# EAGLE schematic soar-noflash (EAGLE 8.3.1)
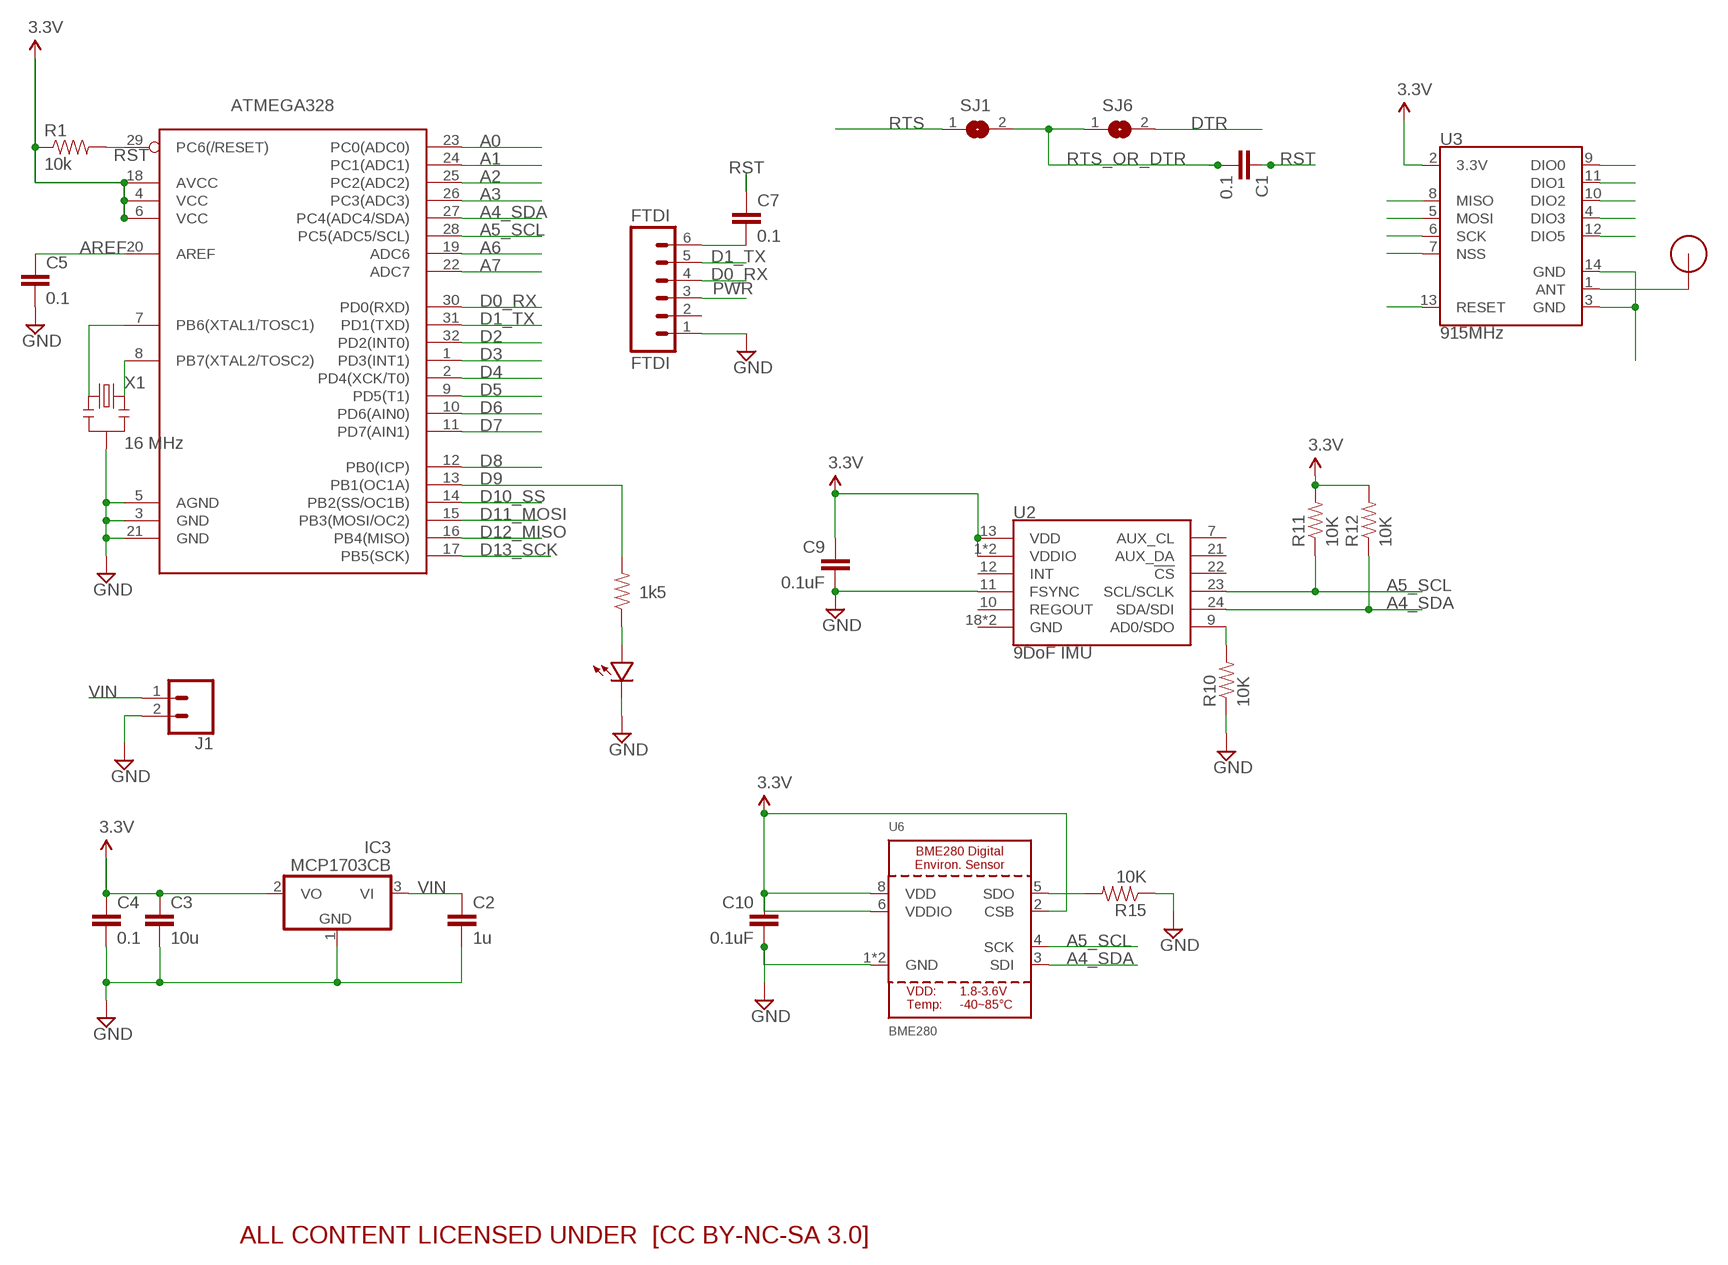
[diagram p0: schematic, sheet 1]

## Parts
ATMEGA328  ATMega-328  ATMEGA168/328TQFP32  [TQFP32-08]
C1  0.1  CAP0603-CAP  [0603-CAP]
C2  1u  CAP0603-CAP  [0603-CAP]
C3  10u  CAP0805-CAP  [0805-CAP]
C4  0.1  CAP0603-CAP  [0603-CAP]
C5  0.1  CAP0603-CAP  [0603-CAP]
C7  0.1  CAP0603-CAP  [0603-CAP]
C9  0.1uF  0.1UF-25V(+80/-20%)(0603)  [0603-CAP]
C10  0.1uF  0.1UF-25V(+80/-20%)(0603)  [0603-CAP]
FTDI  FTDI  M06SIP  [1X06]
IC3  MCP1703CB  [SOT23]
J1  CONN_02-JST-2-PTH-NO_SILK  [JST-2-PTH-NS]
R1  10k  RESISTOR0603-RES  [0603-RES]
R2  1k5  RESISTOR0603-RES  [0603-RES]
R10  10K  10KOHM-1/10W-1%(0603)0603  [0603-RES]
R11  10K  10KOHM-1/10W-1%(0603)0603  [0603-RES]
R12  10K  10KOHM-1/10W-1%(0603)0603  [0603-RES]
R15  10K  10KOHM-1/10W-1%(0603)0603  [0603-RES]
SJ1  JUMPER  [SJW]
SJ6  JUMPER  [SJW]
U2  9DoF IMU  MPU-9250  [QFN24-3X3]
U3  915MHz  RFM69CW-915MHZ  [RFM69CW-XXXS2]
U6  BME280  [BME280]
U$2  LED0603  [0603-LED]
U$3  RFM12B_ANTENNA  [RFM12B-ANTENNA]
X1  16 MHz  RESONATORSMD  [RESONATOR-SMD]

## Nets
A0: ATMEGA328.23(PC0(ADC0))
A1: ATMEGA328.24(PC1(ADC1))
A2: ATMEGA328.25(PC2(ADC2))
A3: ATMEGA328.26(PC3(ADC3))
A4_SDA: ATMEGA328.27(PC4(ADC4/SDA)) R12.1 U2.24(SDA/SDI) U6.3(SDI)
A5_SCL: ATMEGA328.28(PC5(ADC5/SCL)) R11.1 U2.23(SCL/SCLK) U6.4(SCK)
A6: ATMEGA328.19(ADC6)
A7: ATMEGA328.22(ADC7)
AREF: ATMEGA328.20(AREF) C5.1
D0_RX: ATMEGA328.30(PD0(RXD)) FTDI.4
D1_TX: ATMEGA328.31(PD1(TXD)) FTDI.5
D2: ATMEGA328.32(PD2(INT0)) U3.9(DIO0)
D3: ATMEGA328.1(PD3(INT1))
D4: ATMEGA328.2(PD4(XCK/T0))
D5: ATMEGA328.9(PD5(T1))
D6: ATMEGA328.10(PD6(AIN0))
D7: ATMEGA328.11(PD7(AIN1))
D8: ATMEGA328.12(PB0(ICP))
D9: ATMEGA328.13(PB1(OC1A)) R2.2
D10_SS: ATMEGA328.14(PB2(SS/OC1B)) U3.7(NSS)
D11_MOSI: ATMEGA328.15(PB3(MOSI/OC2)) U3.5(MOSI)
D12_MISO: ATMEGA328.16(PB4(MISO)) U3.8(MISO)
D13_SCK: ATMEGA328.17(PB5(SCK)) U3.6(SCK)
DTR: SJ6.2
GND [power]: ATMEGA328.3(GND) ATMEGA328.5(AGND) ATMEGA328.21(GND) C2.2 C3.2 C4.2 C5.2 C10.2 FTDI.1 IC3.1(GND) J1.2 R10.1 R15.1 U6.1(GND) U6.7(GND) U$2.MINUS X1.2
N$1: ATMEGA328.7(PB6(XTAL1/TOSC1)) X1.1
N$2: R2.1 U$2.PLUS
N$3: C9.2 U2.11(FSYNC) ; supply symbol labelled GND
N$10: R15.2 U6.5(SDO)
N$11: R10.2 U2.9(AD0/SDO)
N$12: C7.2 FTDI.6
N$14: U3.13(RESET)
N$16: U3.11(DIO1)
N$17: U3.10(DIO2)
N$18: U3.4(DIO3)
N$19: U3.12(DIO5)
N$20: U3.3(GND) U3.14(GND)
N$21: ATMEGA328.8(PB7(XTAL2/TOSC2)) X1.3
N$22: U3.1(ANT) U$3.P$1
PWR [power]: FTDI.3
RST: ATMEGA328.29(PC6(/RESET)) C1.1 C7.1 R1.2
RTS: SJ1.1
RTS_OR_DTR: C1.2 SJ1.2 SJ6.1
VCC: ATMEGA328.4(VCC) ATMEGA328.6(VCC) ATMEGA328.18(AVCC) C3.1 C4.1 C9.1 C10.1 IC3.2(VO) R1.1 R11.2 R12.2 U2.1(VDDIO) U2.8(VDDIO) U2.13(VDD) U3.2(3.3V) U6.2(CSB) U6.6(VDDIO) U6.8(VDD) ; supply symbol labelled 3.3V
VIN: C2.1 IC3.3(VI) J1.1
Unconnected: FTDI.2 U2.7(AUX_CL) U2.10(REGOUT) U2.12(INT) U2.18(GND) U2.20(GND) U2.21(AUX_DA) U2.22(!CS)

## Notes on the sheet
- ALL CONTENT LICENSED UNDER  [CC BY-NC-SA 3.0]

## Library data of the parts
ATMEGA328 = LowPowerLab:ATMEGA168/328: Atmel 32-pin 8-bit micro, 16k flash.
C1-C5 C7 = LowPowerLab:CAP: Capacitor Standard 0603 ceramic capacitor, and 0.1" leaded capacitor.
C9 C10 = SparkFun-Capacitors:0.1UF-25V(+80/-20%)(0603): CAP-00810 Ceramic Standard decoupling cap; PROD_ID: CAP-00810
FTDI = SparkFun-Connectors:M06: Header 6 Standard 6-pin 0.1" header. Use with straight break away headers (SKU : PRT-00116), right angle break away headers (PRT-00553), swiss pins (PRT-00743), machine pins (PRT-00117), and female headers (PRT-00115). Molex polarized connector foot print use with SKU : PRT-08094 with associated crimp pins and housings. NOTES ON THE VARIANTS LOCK and LOCK_LONGPADS... This footprint was designed to help hold the alignment of a through-hole component (i.e. 6-pin header) while soldering it into place. You may notice that each hole has been shifted either up or down by 0.005 of an inch from it's more standard position (which is a perfectly straight line). This slight alteration caused the pins (the squares in the middle) to touch the edges of the holes. Because they are alternating, it causes a "brace" to hold the component in place. 0.005 has proven to be the perfect amount of "off-center" position when using our standard breakaway headers. Although looks a little odd when you look at the bare footprint, once you have a header in there, the alteration is very hard to notice. Also, if you push a header all the way into place, it is covered up entirely on the bottom side. This idea of altering the position of holes to aid alignment will be further integrated into the Sparkfun Library for other footprints. It can help hold any component with 3 or more connection pins.
IC3 = linear:MCP1703: 250 mA, 16V, Low Quiescent Current LDO Regulator Source: http://ww1.microchip.com/downloads/en/DeviceDoc/22049b.pdf
J1 = SparkFun-Connectors:CONN_02: Multi connection point. Often used as Generic Header-pin footprint for 0.1 inch spaced/style header connections On any of the 0.1 inch spaced packages, you can populate with these: Break Away Headers - Straight <https://www.sparkfun.com/products/116> (PRT-00116) Break Away Male Headers - Right Angle <https://www.sparkfun.com/products/553> (PRT-00553) Female Headers <https://www.sparkfun.com/products/115> (PRT-00115) Break Away Headers - Machine Pin <https://www.sparkfun.com/products/117> (PRT-00117) Break Away Female Headers - Swiss Machine Pin <https://www.sparkfun.com/products/743> (PRT-00743) For SCREWTERMINALS and SPRING TERMINALS visit here: Screw Terimnals on SparkFun.com <https://www.sparkfun.com/search/results?term=Screw+Terminals> (5mm/3.5mm/2.54mm spacing) This device is also useful as a general connection point to wire up your design to another part of your project. Our various solder wires solder well into these plated through hole pads. Hook-Up Wire - Assortment (Stranded, 22 AWG) <https://www.sparkfun.com/products/11375> (PRT-11375) Hook-Up Wire - Assortment (Solid Core, 22 AWG) <https://www.sparkfun.com/products/11367> (PRT-11367) View the entire wire category on our website here <https://www.sparkfun.com/categories/141> Special notes: Molex polarized connector foot print use with: PRT-08233 with associated crimp pins and housings. 2.54_SCREWTERM for use with PRT-10571. 3.5mm Screw Terminal footprints for PRT-08084 5mm Screw Terminal footprints for use with PRT-08432
R1 R2 = LowPowerLab:RESISTOR: Resistor Basic schematic elements and footprints for 0603, 1206, and PTH resistors.
R10-R12 R15 = SparkFun-Resistors:10KOHM-1/10W-1%(0603): RES-00824; PROD_ID: RES-00824
SJ1 SJ6 = LowPowerLab:JUMPER
U2 = SparkFun-Sensors:MPU-9250: MPU-9250 9 Degree of Freedom IMU System in Package that contains MPU-6500 & AK8963 NC pin 19. 2-6 & 14-17 not internally connected. May be used for PCB trace routing. Datasheet <https://cdn.sparkfun.com/assets/learn_tutorials/5/5/0/MPU9250REV1.0.pdf> SparkFun Products: SparkFun 9DoF Razor IMU M0 <https://www.sparkfun.com/products/14001> SparkFun IMU Breakout - MPU-9250 <https://www.sparkfun.com/products/13762>; PROD_ID: IC-13192
U3 = SparkFun-RF:RFM69: Hope RF RFM69CW ISM Transceiver Module The RFM69CW radio module by HopeRF is a compact, powerful radio transceiver module for swapping data packets in the 868 MHz ISM band, using standard and enhanced FSK modulation. The radio is great for sub-compact designs; just 4mm of mounted height from using an SMD precision crystal. Datasheet <http://www.hoperf.com/upload/rf/RFM69CW-V1.1.pdf>; PROD_ID: IC-11996
U6 = microbuilder:BME280: BME280 - Environmental Sensor (I2C + SPI)
U$2 = LowPowerLab:LED
U$3 = LowPowerLab:RFM12B_ANTENNA
X1 = SparkFun:RESONATOR: Resonator Small SMD resonator. This is the itty bitty 10/20MHz resonators with built in caps. CSTCE10M0G55 and CSTCE20M0V53. Footprint has been reviewed closely but hasn't been tested yet.

## Net classes
1 power: width 0.381 mm, clearance 0.254 mm